# EAGLE board SOTB_Feb22 (EAGLE 9.6.2)
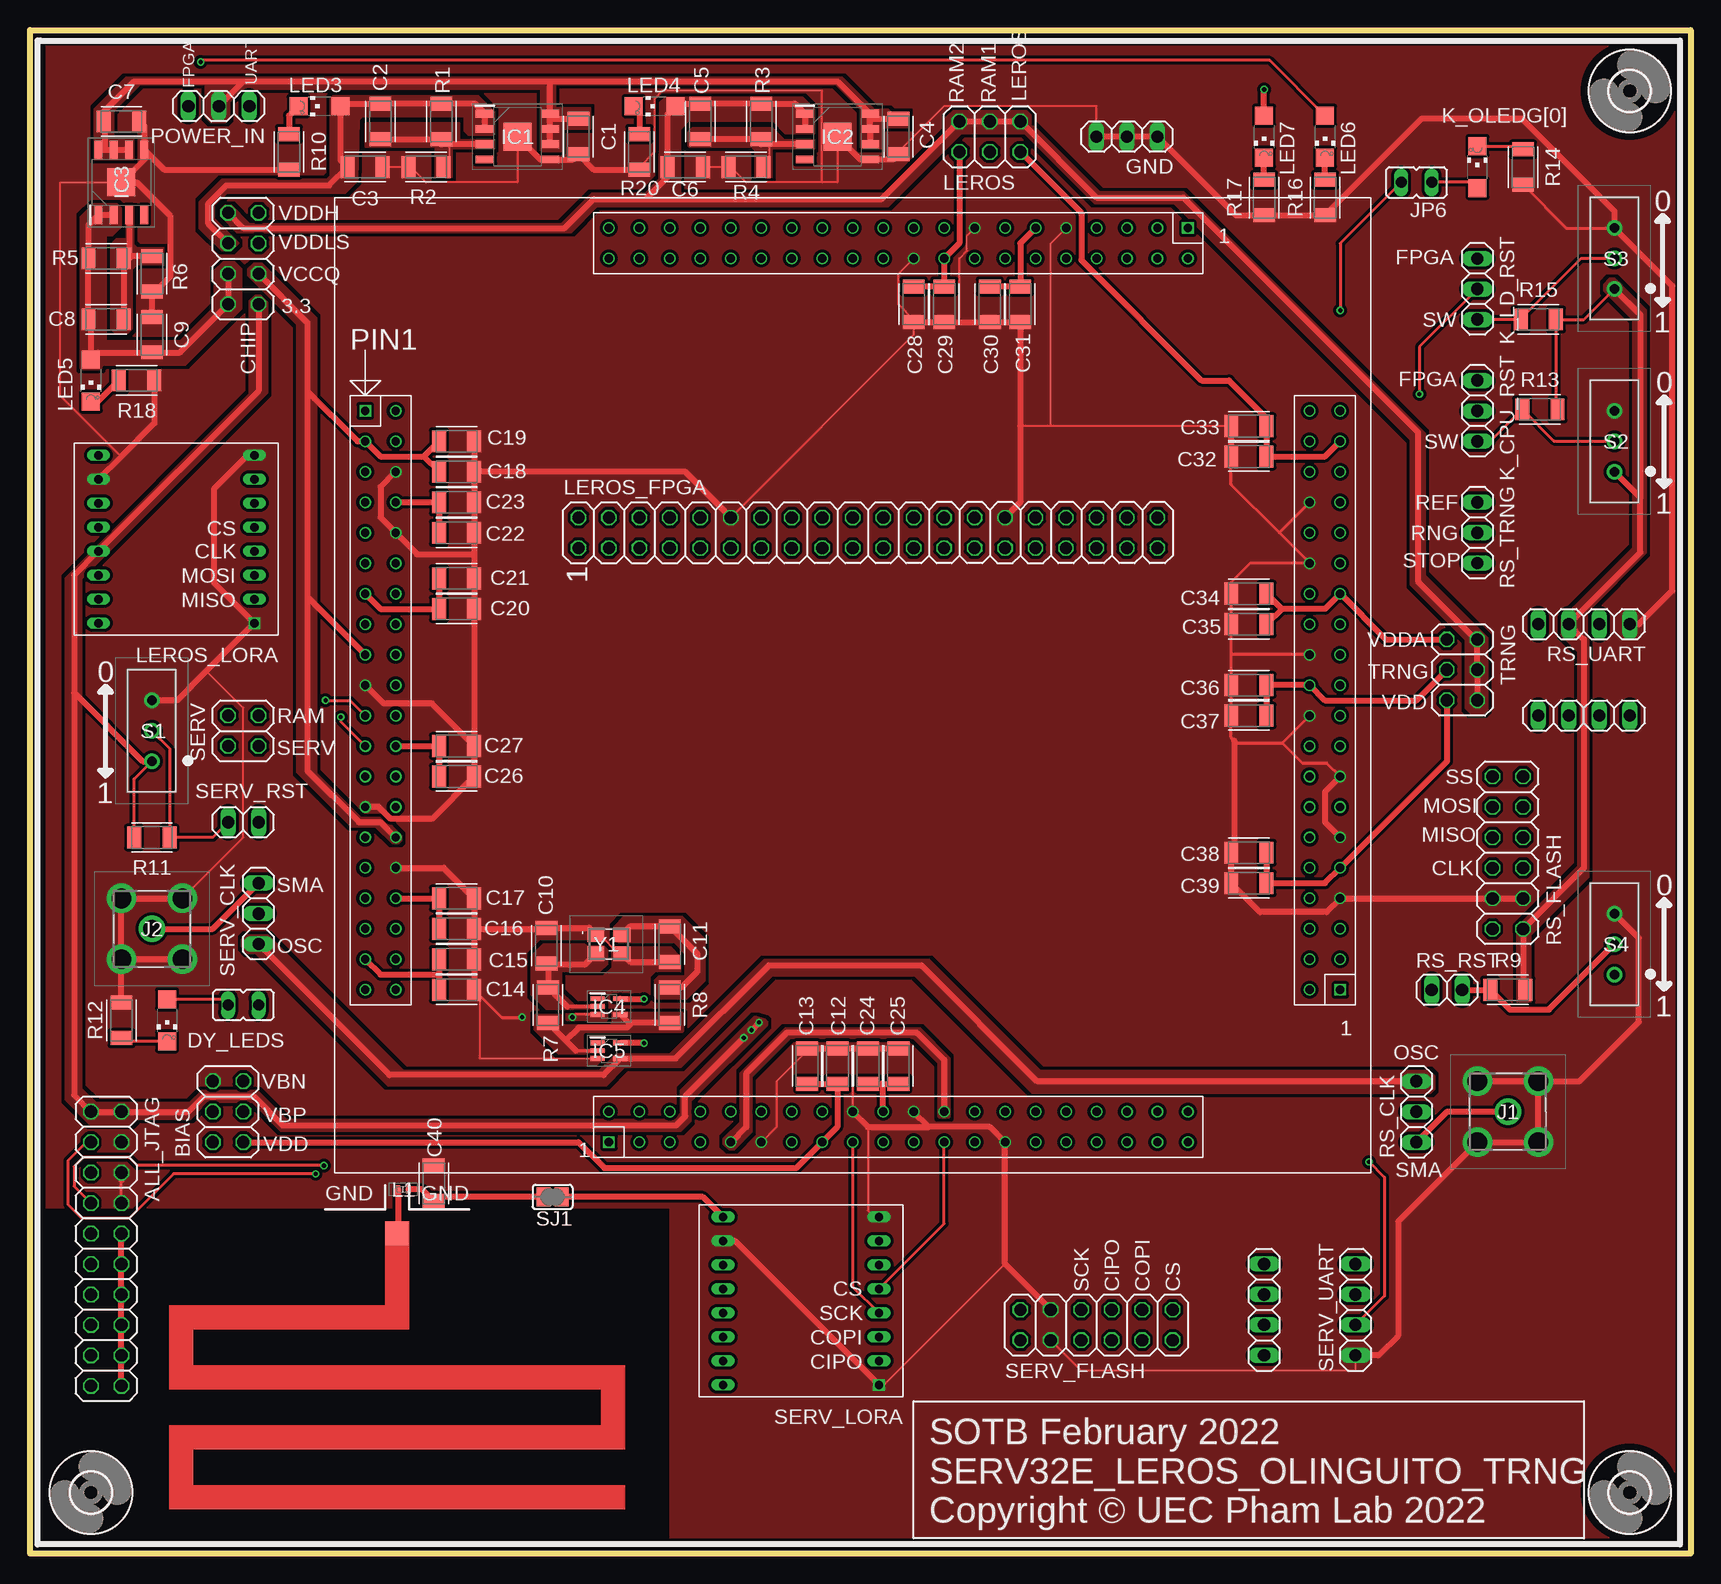
[diagram p2: board, top side]
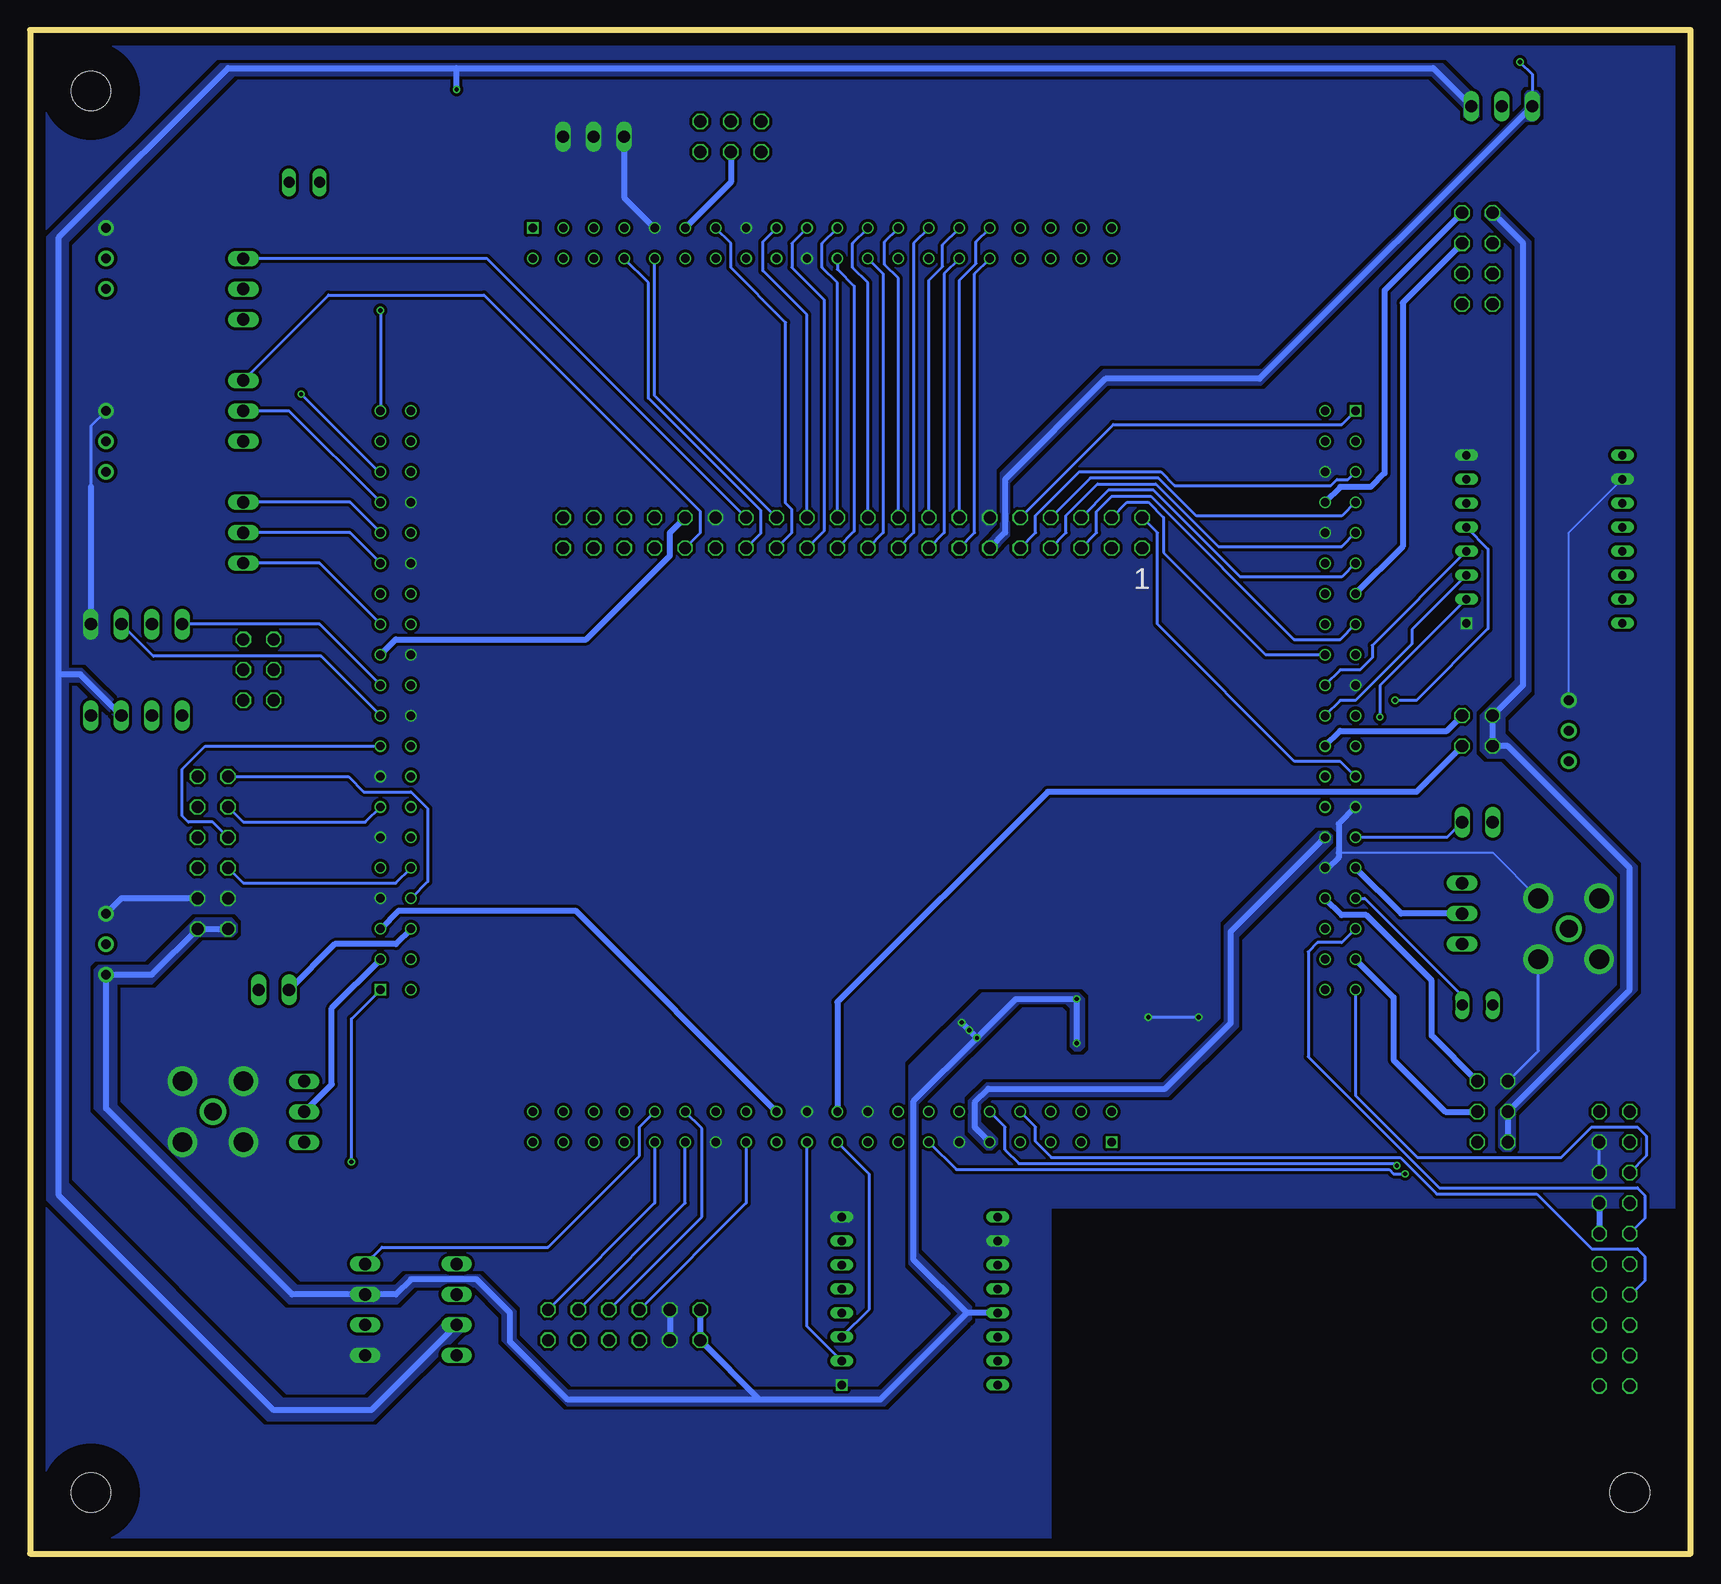
[diagram p3: board, bottom side, seen from below]

Size 138.43 x 127 mm. Coordinates in mm from the lower left corner, seen from the top.
Outline: 0,0 0,127 138.43,127 138.43,0 0,0
Copper layers (1*16): Top 0.035mm / dielectric 1.5mm / Bottom 0.035mm
Design rules "default *": minimum track width 6mil, minimum drill 0.35mm, track to track 10mil, track to pad 10mil, pad to pad 6mil, via to via 10mil, smd to smd 10mil, copper to edge 40mil, drill to drill 6mil, minimum pad ring 0.13mm, minimum via ring 0.13mm, stop-mask expansion 4mil, vias tented up to drill 0mil, thermal gap 10mil

## Footprints (pad centres in the part's own frame; a part is rotated, then mirrored left to right if it is on the bottom)
2X10 = drill 1.016 octagon: 1 -11.43,-1.27; 2 -11.43,1.27; 3 -8.89,-1.27; 4 -8.89,1.27; 5 -6.35,-1.27; 6 -6.35,1.27; 7 -3.81,-1.27; 8 -3.81,1.27; 9 -1.27,-1.27; 10 -1.27,1.27; 11 1.27,-1.27; 12 1.27,1.27; 13 3.81,-1.27; 14 3.81,1.27; 15 6.35,-1.27; 16 6.35,1.27; 17 8.89,-1.27; 18 8.89,1.27; 19 11.43,-1.27; 20 11.43,1.27
2X03 = drill 1.016 octagon: 1 -2.54,-1.27; 2 -2.54,1.27; 3 0,-1.27; 4 0,1.27; 5 2.54,-1.27; 6 2.54,1.27
CAPC3216X135 = smd 1.165 x 1.815: 1 -1.475,0; 2 1.475,0
2X04 = drill 1.016 octagon: 1 -3.81,-1.27; 2 -3.81,1.27; 3 -1.27,-1.27; 4 -1.27,1.27; 5 1.27,-1.27; 6 1.27,1.27; 7 3.81,-1.27; 8 3.81,1.27
CHIPLED_1206 = smd 1.5 x 1.5: A 0,-1.75; C 0,1.75
1X03 = drill 1.016 long: 1 -2.54,0; 2 0,0; 3 2.54,0
3,3 = hole 3.3: 0,0
SOIC127P600X170-9N = smd 1.525 x 0.65: 1 -2.712,1.905; 2 -2.712,0.635; 3 -2.712,-0.635; 4 -2.712,-1.905; 5 2.712,-1.905; 6 2.712,-0.635; 7 2.712,0.635; 8 2.712,1.905 | smd 2.34 x 2.34: 9 0,0
SOT65P210X110-5N = smd 1.2 x 0.4: 1 -0.95,0.65; 2 -0.95,0; 3 -0.95,-0.65; 4 0.95,-0.65; 5 0.95,0.65
29856004 = drill 1.64 pad 2.46: 1 0,0; 2 5.08,0; 3 5.08,5.08; 4 0,5.08 | drill 1.47 pad 2.205: 5 2.54,2.54
JP1 = drill 0.914 long: 1 0,-1.27; 2 0,1.27
LQG15WH0N7B02D = smd 0.35 x 0.65: 1 -0.425,0; 2 0.425,0
2X20 = drill 1.016 octagon: 1 -24.13,-1.27; 2 -24.13,1.27; 3 -21.59,-1.27; 4 -21.59,1.27; 5 -19.05,-1.27; 6 -19.05,1.27; 7 -16.51,-1.27; 8 -16.51,1.27; 9 -13.97,-1.27; 10 -13.97,1.27; 11 -11.43,-1.27; 12 -11.43,1.27; 13 -8.89,-1.27; 14 -8.89,1.27; 15 -6.35,-1.27; 16 -6.35,1.27; 17 -3.81,-1.27; 18 -3.81,1.27; 19 -1.27,-1.27; 20 -1.27,1.27; 21 1.27,-1.27; 22 1.27,1.27; 23 3.81,-1.27; 24 3.81,1.27; 25 6.35,-1.27; 26 6.35,1.27; 27 8.89,-1.27; 28 8.89,1.27; 29 11.43,-1.27; 30 11.43,1.27; 31 13.97,-1.27; 32 13.97,1.27; 33 16.51,-1.27; 34 16.51,1.27; 35 19.05,-1.27; 36 19.05,1.27; 37 21.59,-1.27; 38 21.59,1.27; 39 24.13,-1.27; 40 24.13,1.27
RFM95W-915S2 = drill 0.7 square: P$1 -6,5 | drill 0.7 long: P$2 -6,3; P$3 -6,1; P$4 -6,-1; P$5 -6,-3; P$6 -6,-5; P$7 -6,-7; P$8 -6,-9; P$9 7,5; P$10 7,3; P$11 7,1; P$12 7,-1; P$13 7,-3; P$14 7,-5; P$15 7,-7; P$16 7,-9
RESC3216X70 = smd 1.165 x 1.815: 1 -1.475,0; 2 1.475,0
2X06 = drill 1.016 octagon: 1 -6.35,-1.27; 2 -6.35,1.27; 3 -3.81,-1.27; 4 -3.81,1.27; 5 -1.27,-1.27; 6 -1.27,1.27; 7 1.27,-1.27; 8 1.27,1.27; 9 3.81,-1.27; 10 3.81,1.27; 11 6.35,-1.27; 12 6.35,1.27
1X02 = drill 1.016 long: 1 -1.27,0; 2 1.27,0
1X04 = drill 1.016 long: 1 -3.81,0; 2 -1.27,0; 3 1.27,0; 4 3.81,0
SS12SDP2 = drill 0.8 pad 1.3: 1 0,2.54; 2 0,0; 3 0,-2.54
2X02 = drill 1.016 octagon: 1 -1.27,-1.27; 2 -1.27,1.27; 3 1.27,-1.27; 4 1.27,1.27
SJ = smd 1.168 x 1.6: 1 -0.762,0; 2 0.762,0
QFP28-160PIN = drill 0.7 square: P$1 -40.64,22.86; P$41 -20.32,-38.1; P$81 40.64,-25.4; P$121 27.94,38.1 | drill 0.7: P$2 -38.1,22.86; P$3 -40.64,20.32; P$4 -38.1,20.32; P$5 -40.64,17.78; P$6 -38.1,17.78; P$7 -40.64,15.24; P$8 -38.1,15.24; P$9 -40.64,12.7; P$10 -38.1,12.7; P$11 -40.64,10.16; P$12 -38.1,10.16; P$13 -40.64,7.62; P$14 -38.1,7.62; P$15 -40.64,5.08; P$16 -38.1,5.08; P$17 -40.64,2.54; P$18 -38.1,2.54; P$19 -40.64,0; P$20 -38.1,0; P$21 -40.64,-2.54; P$22 -38.1,-2.54; P$23 -40.64,-5.08; P$24 -38.1,-5.08; P$25 -40.64,-7.62; P$26 -38.1,-7.62; P$27 -40.64,-10.16; P$28 -38.1,-10.16; P$29 -40.64,-12.7; P$30 -38.1,-12.7; P$31 -40.64,-15.24; P$32 -38.1,-15.24; P$33 -40.64,-17.78; P$34 -38.1,-17.78; P$35 -40.64,-20.32; P$36 -38.1,-20.32; P$37 -40.64,-22.86; P$38 -38.1,-22.86; P$39 -40.64,-25.4; P$40 -38.1,-25.4; P$42 -20.32,-35.56; P$43 -17.78,-38.1; P$44 -17.78,-35.56; P$45 -15.24,-38.1; P$46 -15.24,-35.56; P$47 -12.7,-38.1; P$48 -12.7,-35.56; P$49 -10.16,-38.1; P$50 -10.16,-35.56; P$51 -7.62,-38.1; P$52 -7.62,-35.56; P$53 -5.08,-38.1; P$54 -5.08,-35.56; P$55 -2.54,-38.1; P$56 -2.54,-35.56; P$57 0,-38.1; P$58 0,-35.56; P$59 2.54,-38.1; P$60 2.54,-35.56; P$61 5.08,-38.1; P$62 5.08,-35.56; P$63 7.62,-38.1; P$64 7.62,-35.56; P$65 10.16,-38.1; P$66 10.16,-35.56; P$67 12.7,-38.1; P$68 12.7,-35.56; P$69 15.24,-38.1; P$70 15.24,-35.56; P$71 17.78,-38.1; P$72 17.78,-35.56; P$73 20.32,-38.1; P$74 20.32,-35.56; P$75 22.86,-38.1; P$76 22.86,-35.56; P$77 25.4,-38.1; P$78 25.4,-35.56; P$79 27.94,-38.1; P$80 27.94,-35.56; P$82 38.1,-25.4; P$83 40.64,-22.86; P$84 38.1,-22.86; P$85 40.64,-20.32; P$86 38.1,-20.32; P$87 40.64,-17.78; P$88 38.1,-17.78; P$89 40.64,-15.24; P$90 38.1,-15.24; P$91 40.64,-12.7; P$92 38.1,-12.7; P$93 40.64,-10.16; P$94 38.1,-10.16; P$95 40.64,-7.62; P$96 38.1,-7.62; P$97 40.64,-5.08; P$98 38.1,-5.08; P$99 40.64,-2.54; P$100 38.1,-2.54; P$101 40.64,0; P$102 38.1,0; P$103 40.64,2.54; P$104 38.1,2.54; P$105 40.64,5.08; P$106 38.1,5.08; P$107 40.64,7.62; P$108 38.1,7.62; P$109 40.64,10.16; P$110 38.1,10.16; P$111 40.64,12.7; P$112 38.1,12.7; P$113 40.64,15.24; P$114 38.1,15.24; P$115 40.64,17.78; P$116 38.1,17.78; P$117 40.64,20.32; P$118 38.1,20.32; P$119 40.64,22.86; P$120 38.1,22.86; P$122 27.94,35.56; P$123 25.4,38.1; P$124 25.4,35.56; P$125 22.86,38.1; P$126 22.86,35.56; P$127 20.32,38.1; P$128 20.32,35.56; P$129 17.78,38.1; P$130 17.78,35.56; P$131 15.24,38.1; P$132 15.24,35.56; P$133 12.7,38.1; P$134 12.7,35.56; P$135 10.16,38.1; P$136 10.16,35.56; P$137 7.62,38.1; P$138 7.62,35.56; P$139 5.08,38.1; P$140 5.08,35.56; P$141 2.54,38.1; P$142 2.54,35.56; P$143 0,38.1; P$144 0,35.56; P$145 -2.54,38.1; P$146 -2.54,35.56; P$147 -5.08,38.1; P$148 -5.08,35.56; P$149 -7.62,38.1; P$150 -7.62,35.56; P$151 -10.16,38.1; P$152 -10.16,35.56; P$153 -12.7,38.1; P$154 -12.7,35.56; P$155 -15.24,38.1; P$156 -15.24,35.56; P$157 -17.78,38.1; P$158 -17.78,35.56; P$159 -20.32,38.1; P$160 -20.32,35.56
868MHZ_ANTENNA_DN024 = smd 2 x 2: P$1 0,1
NX3225GA12MHZSTDCRG2 = smd 1.4 x 1.2: 1 -1.1,-0.8; 2 1.1,-0.8; 3 1.1,0.8; 4 -1.1,0.8

## Placement (x,y rotation side)
ALL_JTAG  [2X10]  6.35,25.4 270 top
BIAS  PINHD-2X3  [2X03]  16.51,36.83 90 top
C1  10uF  [CAPC3216X135]  45.72,118.11 270 top
C2  4.7nF  [CAPC3216X135]  29.21,119.38 270 top
C3  10uF  [CAPC3216X135]  27.94,115.57 0 top
C4  10uF  [CAPC3216X135]  72.39,118.11 270 top
C5  3.3nF  [CAPC3216X135]  55.88,119.38 270 top
C6  10uF  [CAPC3216X135]  54.61,115.57 0 top
C7  10uF  [CAPC3216X135]  7.62,119.38 0 top
C8  2.7nF  [CAPC3216X135]  6.35,102.87 0 top
C9  10uF  [CAPC3216X135]  10.16,101.6 90 top
C10  16pF  [CAPC3216X135]  43.05,50.67 90 top
C11  16pF  [CAPC3216X135]  53.34,50.8 270 top
C12  10uF  [CAPC3216X135]  67.31,40.64 90 top
C13  0.1uF  [CAPC3216X135]  64.77,40.64 90 top
C14  10uF  [CAPC3216X135]  35.56,46.99 0 top
C15  0.1uF  [CAPC3216X135]  35.56,49.53 0 top
C16  10uF  [CAPC3216X135]  35.56,52.07 0 top
C17  0.1uF  [CAPC3216X135]  35.56,54.61 0 top
C18  10uF  [CAPC3216X135]  35.56,90.17 0 top
C19  0.1uF  [CAPC3216X135]  35.56,92.71 0 top
C20  10uF  [CAPC3216X135]  35.56,78.74 0 top
C21  0.1uF  [CAPC3216X135]  35.56,81.28 0 top
C22  10uF  [CAPC3216X135]  35.56,85.09 0 top
C23  0.1uF  [CAPC3216X135]  35.56,87.63 0 top
C24  10uF  [CAPC3216X135]  69.85,40.64 90 top
C25  0.1uF  [CAPC3216X135]  72.39,40.64 90 top
C26  10uF  [CAPC3216X135]  35.56,64.77 0 top
C27  0.1uF  [CAPC3216X135]  35.56,67.31 0 top
C28  10uF  [CAPC3216X135]  73.66,104.14 270 top
C29  0.1uF  [CAPC3216X135]  76.2,104.14 270 top
C30  10uF  [CAPC3216X135]  80.01,104.14 270 top
C31  0.1uF  [CAPC3216X135]  82.55,104.14 270 top
C32  10uF  [CAPC3216X135]  101.6,91.44 180 top
C33  0.1uF  [CAPC3216X135]  101.6,93.98 180 top
C34  10uF  [CAPC3216X135]  101.6,80.01 180 top
C35  0.1uF  [CAPC3216X135]  101.6,77.47 180 top
C36  10uF  [CAPC3216X135]  101.6,72.39 180 top
C37  0.1uF  [CAPC3216X135]  101.6,69.85 180 top
C38  10uF  [CAPC3216X135]  101.6,58.42 180 top
C39  0.1uF  [CAPC3216X135]  101.6,55.88 180 top
C40  2.7pF  [CAPC3216X135]  33.66,30.86 90 top
CHIP  PINHD-2X4  [2X04]  17.78,107.95 90 top
DY_LEDS  [CHIPLED_1206]  11.43,44.45 180 top
GND  [1X03]  91.44,118.11 180 top
H1  MOUNT-HOLE3.3  [3,3]  133.35,5.08 0 top
H2  MOUNT-HOLE3.3  [3,3]  133.35,121.92 0 top
H3  MOUNT-HOLE3.3  [3,3]  5.08,5.08 0 top
IC1  LP38511MR-ADJ_NOPB  [SOIC127P600X170-9N]  40.64,118.11 0 top
IC2  LP38511MR-ADJ_NOPB  [SOIC127P600X170-9N]  67.31,118.11 0 top
IC3  LP38511MR-ADJ_NOPB  [SOIC127P600X170-9N]  7.62,114.3 90 top
IC4  SN74LVC1GU04DCKR  [SOT65P210X110-5N]  48.26,45.59 0 top
IC5  SN74LVC1G14DCKR  [SOT65P210X110-5N]  48.26,41.91 0 top
J1  2985-6004  [29856004]  125.73,39.37 180 top
J2  2985-6004  [29856004]  7.62,49.53 0 top
JP6  [JP1]  115.57,114.3 90 top
JP7  [JP1]  17.78,45.72 270 top
K_CPU_RST  [1X03]  120.65,95.25 270 top
K_LD_RST  [1X03]  120.65,105.41 270 top
K_OLEDG[0]  [CHIPLED_1206]  120.65,115.57 0 top
L1  LQG15HS1N8S02D  [LQG15WH0N7B02D]  31.11,30.35 180 top
LED3  [CHIPLED_1206]  24.13,120.65 90 top
LED4  [CHIPLED_1206]  52.07,120.65 90 top
LED5  [CHIPLED_1206]  5.08,97.79 180 top
LED6  [CHIPLED_1206]  107.95,118.11 180 top
LED7  [CHIPLED_1206]  102.87,118.11 180 top
LEROS  PINHD-2X3  [2X03]  80.01,118.11 0 top
LEROS_FPGA  [2X20]  69.85,85.09 0 top
LEROS_LORA  [RFM95W-915S2]  12.7,82.55 180 top
POWER_IN  [1X03]  15.75,120.65 180 top
R1  1.07k  [RESC3216X70]  34.29,119.38 270 top
R2  1.78k  [RESC3216X70]  33.02,115.57 0 top
R3  1.4k  [RESC3216X70]  60.96,119.38 270 top
R4  1k  [RESC3216X70]  59.69,115.57 0 top
R5  2k  [RESC3216X70]  6.35,107.95 0 top
R6  357  [RESC3216X70]  10.16,106.68 90 top
R7  2.2M  [RESC3216X70]  43.18,45.72 270 top
R8  1k  [RESC3216X70]  53.34,45.72 270 top
R9  10k  [RESC3216X70]  123.19,46.99 0 top
R10  100  [RESC3216X70]  21.59,116.84 90 top
R11  10k  [RESC3216X70]  10.16,59.69 180 top
R12  1k  [RESC3216X70]  7.62,44.45 270 top
R13  10k  [RESC3216X70]  125.86,95.38 0 top
R14  1k  [RESC3216X70]  124.46,115.57 90 top
R15  10k  [RESC3216X70]  125.73,102.87 0 top
R16  1k  [RESC3216X70]  107.95,113.03 90 top
R17  1k  [RESC3216X70]  102.87,113.03 90 top
R18  1k  [RESC3216X70]  8.89,97.79 180 top
R20  330  [RESC3216X70]  50.8,116.84 90 top
RS_CLK  [1X03]  115.57,36.83 90 top
RS_FLASH  PINHD-2X6  [2X06]  123.19,58.42 90 top
RS_RST  [1X02]  118.11,46.99 0 top
RS_TRNG  PINHD-1X3  [1X03]  120.65,85.09 270 top
RS_UART  PINHD-1X4  [1X04]  129.54,77.47 180 top
S1  SS12SDP2  [SS12SDP2]  10.16,68.58 180 top
S2  SS12SDP2  [SS12SDP2]  132.08,92.71 180 top
S3  SS12SDP2  [SS12SDP2]  132.08,107.95 180 top
S4  SS12SDP2  [SS12SDP2]  132.08,50.8 180 top
SERV  PINHD-2X2  [2X02]  17.78,68.58 90 top
SERV_CLK  [1X03]  19.05,53.34 270 top
SERV_FLASH  PINHD-2X6  [2X06]  88.9,19.05 0 top
SERV_LORA  [RFM95W-915S2]  64.77,19.05 180 top
SERV_RST  [1X02]  17.78,60.96 180 top
SERV_UART  PINHD-1X4  [1X04]  110.49,20.32 90 top
SJ1  [SJ]  43.56,29.72 180 top
SOCKET  [QFP28-160PIN]  68.58,72.39 0 top
TRNG  PINHD-2X3  [2X03]  119.38,73.66 270 top
U$1  [868MHZ_ANTENNA_DN024]  30.61,27.69 180 top
USB-UART_2  PINHD-1X4  [1X04]  102.87,20.32 90 top
USB-UART_4  PINHD-1X4  [1X04]  129.54,69.85 180 top
Y1  NX3225GA-12MHZ-STD-CRG-2  [NX3225GA12MHZSTDCRG2]  48.26,50.8 0 top

## Tracks (layer width: path | path; a pad name or v marks a point on that pad's centre or on a via)
CLOCK_OSC
  Top 0.508: SERV_CLK.3 29.97,39.88 47.83,39.88 IC5.4 53.83,41.26 61.59,49.02 74.3,49.02 83.95,39.37 RS_CLK.3
  pour Top (no thermals): 48.89,41.66 47.5,40.26 31.11,40.26 19.81,51.56 18.03,51.56 17.65,51.18 17.65,50.55 18.16,50.04 18.8,50.04 29.84,38.99 48.01,38.99 49.53,40.51 54.23,40.51 61.85,48.13 73.79,48.13 83.57,38.35 116.71,38.35 117.09,38.73 117.09,39.75 116.59,40.26 84.2,40.26 74.93,49.53 61.21,49.53 53.34,41.66
DY_ALL_I_SPI_CIPO
  Bottom 0.254: SERV_LORA.P$2 73.66,18.94 SOCKET.P$61
DY_ALL_I_SPIFLASH_CIPO
  Bottom 0.254: SERV_FLASH.8 82.42,28.07 82.42,35.43 SOCKET.P$70
DY_ALL_I_TCK
  Bottom 0.254: SOCKET.P$35 29.08,50.93 31.11,50.93 31.88,50.17 31.88,41.4 20.95,30.48 4.45,30.48 3.81,29.84 3.81,27.94 ALL_JTAG.9
DY_ALL_I_TDI
  Bottom 0.254: SOCKET.P$39 27.94,38.18 22.78,33.02 10.79,33.02 8.25,35.56 4.45,35.56 3.68,34.8 3.68,33.15 ALL_JTAG.5
DY_ALL_I_TMS  (via drill 0.35)
  Top 0.254: ALL_JTAG.7 3.68,30.61 3.68,32.26 4.45,33.02 8.25,33.02 8.94,32.33 v24.5,32.33
  Bottom 0.254: SOCKET.P$50 57.15,35.56 57.15,33.66 56.01,32.51 24.68,32.51 v24.5,32.33
DY_ALL_I_TRST  (via drill 0.35)
  Top 0.254: v23.81,31.65 11.96,31.65 8.25,27.94 4.32,27.94 3.17,29.08 3.17,32.77 4.7,34.29 ALL_JTAG.3
  Bottom 0.254: SOCKET.P$53 61.21,32 25.14,32 24.78,31.65 v23.81,31.65
DY_ALL_LEDS[0]
  Bottom 0.254: SOCKET.P$33 27.18,54.61 19.05,46.48 JP7.2
DY_ALL_O_SPI_COPI
  Bottom 0.254: SERV_LORA.P$3 68.45,20.37 68.45,31.62 SOCKET.P$59
DY_ALL_O_SPI_CS
  Top 0.254: SERV_LORA.P$5 76.2,27.48 SOCKET.P$63
DY_ALL_O_SPI_SCK
  Top 0.254: SOCKET.P$57 68.58,22.24 SERV_LORA.P$4
DY_ALL_O_SPIFLASH_COPI
  Bottom 0.254: SERV_FLASH.10 83.82,29.21 SOCKET.P$69
DY_ALL_O_SPIFLASH_CS
  Bottom 0.254: SOCKET.P$71 86.36,29.21 SERV_FLASH.12
DY_ALL_O_SPIFLASH_SCK
  Bottom 0.254: SOCKET.P$65 78.74,29.21 SERV_FLASH.6
DY_ALL_O_TDO
  Bottom 0.254: SOCKET.P$48 54.61,35.56 54.61,34.34 53.29,33.02 24.21,33.02 21.16,29.97 12.83,29.97 8.25,25.4 4.45,25.4 3.81,24.77 3.81,22.73 4.95,21.59 ALL_JTAG.13
DY_ALL_RESET
  Bottom 0.254: SERV_RST.1 20.32,59.69 SOCKET.P$29
DY_ALL_RX_IN  (via drill 0.35)
  Top 0.254: SERV_UART.2 112.9,21.46 112.9,31.37 v111.63,32.64
  Bottom 0.254: v111.63,32.64 111.63,44.58 SOCKET.P$81
DY_ALL_TX_OUT
  Bottom 0.254: SERV_UART.4 109.09,25.53 95.25,25.53 87.63,33.15 87.63,35.56 SOCKET.P$72
DY_CLOCK
  Bottom 0.508: SERV_CLK.2 24.13,53.34 SOCKET.P$31
DY_RAM_VDD
  Top 0.508: SOCKET.P$24 C27.1 C26.1
  Bottom 0.508: SERV.3 20.32,68.58 29.21,68.58 SOCKET.P$24
DY_SERV_VDD
  Top 0.508: C24.1 70.99,39.17 | 70.99,39.17 C25.1 | SOCKET.P$60 71.12,39.04 70.99,39.17
  Bottom 0.508: SERV.1 22.86,63.5 53.59,63.5 71.12,45.97 SOCKET.P$60
GND  (via drill 0.35)
  Top 0.152: 14.71,73.56 17.78,70.48 17.78,59.69 J2.3 | IC3.9 2.54,114.3 2.54,96.52 7.6,91.45 | C3.2 R2.1 31.75,115.57 33.02,114.3 40.64,114.3 IC1.9 | C6.2 R4.1 58.42,115.57 59.69,114.3 66.04,114.3 | 66.04,114.3 67.31,114.3 IC2.9 | 66.04,114.3 66.04,121.92 52.7,121.92 52.07,121.28 52.07,116.84 50.8,115.57 R20.1 | GND.3 88.9,120.65 76.2,120.65 72.39,116.84 C4.2 | 69.85,35.56 69.85,28.58 70.48,27.94 SERV_LORA.P$8 | SOCKET.P$51 62.23,35.56 62.23,39.37 64.77,41.91 C13.2 | 68.58,42.11 SOCKET.P$58 | 81.28,24.13 71.12,13.97 SERV_LORA.P$1 | IC5.3 46.99,41.28 37.46,41.28 37.46,46.99 C14.2 | Y1.2 48.89,50.17 47.62,51.44 Y1.4 | SOCKET.P$140 72.39,106.68 72.39,104.14 73.66,102.87 C28.2 73.66,101.6 LEROS_FPGA.12 | SOCKET.P$135 78.1,109.86 78.1,108.59 77.47,107.95 77.47,102.66 | C33.2 85.09,93.98 | 85.09,93.98 82.55,93.98 | SERV_FLASH.3 87.63,15.24 110.49,15.24 SERV_UART.1 | SOCKET.P$129 85.09,109.22 85.09,93.98 | ALL_JTAG.8 7.62,30.02
  Top 0.254: R14.1 128.06,110.49 S3.3 | 104.14,85.09 SOCKET.P$110 101.73,82.55 100.12,80.95 C34.2 C35.2 100.12,74.93 | 104.14,85.09 100.12,89.1 100.12,91.19 C32.2 | SOCKET.P$114 104.14,85.09 | 100.12,74.93 C36.2 C37.2 100.12,68.02 100.39,67.75 100.58,67.56 104.39,67.56 | SOCKET.P$104 100.12,74.93 | SOCKET.P$100 104.39,67.56 | SOCKET.P$95 108.08,65.91 106.05,65.91 104.39,67.56 | IC4.3 45.45,44.94 v45.21,44.7 | C14.2 39.32,44.7 v41.02,44.7 | ALL_JTAG.8 ALL_JTAG.6
  Top 0.508: IC1.9 42.55,116.2 IC1.5 45.29,116.2 C1.2 46.99,115.36 R20.1 | R6.1 10.16,104.9 | 10.16,104.9 C9.2 | IC3.5 9.52,116.2 IC3.9 8.89,114.3 11.68,111.51 11.68,106.43 10.16,104.9 | C7.2 9.52,118.95 IC3.5 | IC3.5 11.17,115.36 R10.1 | C16.2 C17.2 34.49,57.15 SOCKET.P$32 | C16.2 C15.2 C14.2 | C16.2 42.97,52.07 C10.2 46.61,52.15 Y1.4 | Y1.2 50.03,49.33 C11.2 | J2.1 J2.4 J2.3 | J2.2 J2.1 | R12.1 J2.1 | S1.3 12.27,71.12 14.71,73.56 LEROS_LORA.P$1 15.37,80.88 15.37,88.77 18.14,91.55 LEROS_LORA.P$8 | R18.1 10.36,94.22 7.6,91.45 LEROS_LORA.P$15 | J1.1 J1.4 J1.3 114.05,27.69 114.05,18.16 112.39,16.51 SERV_UART.1 | J1.1 J1.2 | C4.2 71.96,116.2 IC2.5 69.22,116.2 IC2.9 | R17.1 R16.1 | R16.1 100.53,111.56 GND.1 GND.2 GND.3 | C28.2 C29.2 77.47,102.66 C30.2 C31.2 82.55,93.98 82.55,87.63 LEROS_FPGA.30 | C33.2 100.12,91.19 | SOCKET.P$27 29.08,62.23 30.07,61.24 33.51,61.24 C26.2 C27.2 | C27.2 33.48,70.87 29.46,70.87 SOCKET.P$19 | C21.2 C20.2 | C19.2 C18.2 | C18.2 C23.2 C22.2 37.03,83.31 | 37.03,83.31 C21.2 | C21.2 C27.2 | SOCKET.P$6 29.21,88.9 29.21,86.36 SOCKET.P$10 32.26,83.31 37.03,83.31 | LEROS_FPGA.12 54.61,90.17 C18.2 | R16.1 116.03,119.63 124.33,119.63 132.08,111.89 S3.3 136.91,105.66 136.91,80.26 134.11,77.47 RS_UART.1 | RS_FLASH.3 RS_FLASH.4 SOCKET.P$87 108.08,53.47 102.54,53.47 C39.2 C38.2 100.39,58.69 100.39,67.75 | SOCKET.P$95 107.95,63.5 107.95,60.96 SOCKET.P$91 | J1.1 129.16,39.37 134.11,44.32 134.11,51.31 S4.3 | SERV_FLASH.4 81.28,24.13 SOCKET.P$67 80.01,35.56 74.93,35.56 | 74.93,35.56 SOCKET.P$62 | SOCKET.P$58 69.85,35.56 74.93,35.56 | C13.2 C12.2 68.58,42.11 C24.2 C25.2 | SERV_LORA.P$1 58.77,26.05 SERV_LORA.P$15 57.75,26.03
  Top 0.508: ALL_JTAG.20 ALL_JTAG.18 ALL_JTAG.16 ALL_JTAG.14 ALL_JTAG.12 ALL_JTAG.10 | ALL_JTAG.6 7.62,31.11
  Bottom 0.152: LEROS_LORA.P$15 10.16,85.09 S1.3 | J2.3 16.51,58.42 29.34,58.42
  Bottom 0.254: BIAS.6 12.7,41.91 J2.2 | v41.02,44.7 v45.21,44.7 | ALL_JTAG.6 ALL_JTAG.4 | S2.3 133.35,93.98 133.35,88.77
  Bottom 0.508: SOCKET.P$27 29.34,60.83 29.34,58.42 29.34,58.04 30.23,57.15 SOCKET.P$32 | GND.3 88.9,113.03 SOCKET.P$129 | 133.35,88.9 133.35,88.77 RS_UART.1 | RS_FLASH.3 130.81,54.61 S4.3 | SERV_FLASH.4 SERV_FLASH.3 | ALL_JTAG.8 ALL_JTAG.10
  pour Top (rank 2, no thermals): -3.81,132.08 146.05,132.08 146.05,-10.16 53.34,-10.16 53.34,28.83 -3.81,28.83
  pour Bottom (rank 2, no thermals): -5.08,132.08 147.32,132.08 147.32,-11.43 53.34,-11.43 53.34,28.83 -5.08,28.83
IN_3.3
  Top 0.508: IC1.6 IC1.7 43.35,119.51 | 43.35,119.51 IC1.8 43.35,122.64 43.31,122.68 | IC2.6 IC2.7 70.02,119.38 | IC3.8 6.22,117.01 | 6.22,117.01 IC3.7 IC3.6 | 6.22,117.01 6.22,119.3 C7.1 6.14,120.19 8.64,122.68 17.78,122.68 | 70.02,119.38 IC2.8 67.35,122.68 43.31,122.68 | 70.02,119.38 70.23,119.58 C4.1 | 17.78,122.68 POWER_IN.2 | 43.31,122.68 17.78,122.68 | 43.35,119.51 43.43,119.58 C1.1
  pour Top (no thermals): 8.64,118.11 8.64,116.2 5.33,116.2 5.33,120.4 8,123.06 67.69,123.06 70.36,120.4 71.5,120.4 71.75,120.14 73.28,120.14 73.28,118.87 70.99,118.87 70.99,117.09 69.34,117.09 69.22,117.22 69.22,120.4 67.18,122.43 43.81,122.43 43.81,120.52 46.74,120.52 46.74,118.75 44.32,118.75 44.32,116.84 42.67,116.84 42.55,116.97 42.55,122.05 17.65,122.05 16.64,121.03 16.64,119.63 16.26,119.25 15.11,119.25 14.6,119.76 14.6,122.43 9.14,122.43 6.98,120.27 6.98,118.11
K_CLK
  Bottom 0.508: SOCKET.P$103 107.95,76.2 92.07,76.2 85.09,83.19 85.09,85.09 LEROS_FPGA.32
K_CPU_RST_N
  Bottom 0.254: SOCKET.P$113 116.84,95.25 K_CPU_RST.2
K_CPU_RST_N_FPGA
  Bottom 0.254: LEROS_FPGA.31 82.55,85.09 82.55,86.87 100.58,104.9 113.54,104.9 K_CPU_RST.1
K_FL_ADDR[0]
  Bottom 0.254: LEROS_FPGA.27 77.51,85.05 77.51,86.95 86.87,96.31 86.87,105.92 SOCKET.P$128
K_FL_ADDR[1]
  Bottom 0.254: LEROS_FPGA.26 86.36,96.52 SOCKET.P$130
K_FL_ADDR[2]
  Bottom 0.254: LEROS_FPGA.25 74.93,85.09 74.93,87.04 75.44,87.55 75.44,102.62 80.01,107.19 80.01,109.22 SOCKET.P$133
K_FL_ADDR[3]
  Bottom 0.254: LEROS_FPGA.24 73.66,103.25 77.34,106.93 77.34,109.35 SOCKET.P$137
K_FL_ADDR[4]
  Bottom 0.254: LEROS_FPGA.23 72.26,85.22 72.26,104.52 74.93,107.19 74.93,109.22 SOCKET.P$139
K_FL_ADDR[5]
  Bottom 0.254: LEROS_FPGA.22 71.12,105.92 72.39,107.19 72.39,109.22 SOCKET.P$141
K_FL_ADDR[6]
  Bottom 0.254: SOCKET.P$142 71.12,107.06 69.72,105.66 69.72,85.22 LEROS_FPGA.21
K_FL_ADDR[7]
  Bottom 0.254: LEROS_FPGA.20 68.58,105.92 69.85,107.19 69.85,109.22 SOCKET.P$143
K_FL_ADDR[8]
  Bottom 0.254: SOCKET.P$144 67.31,106.68 67.31,85.09 LEROS_FPGA.19
K_FL_ADDR[9]
  Bottom 0.254: LEROS_FPGA.18 66.04,106.3 67.18,107.44 67.18,109.35 SOCKET.P$145
K_FL_CE_N
  Bottom 0.254: LEROS_FPGA.7 52.07,85.09 52.07,86.53 49.45,89.15 44.58,89.15 39.37,83.95 29.08,83.95 SOCKET.P$9
K_FL_DATA[0]
  Bottom 0.254: SOCKET.P$147 64.77,109.22 64.77,85.09 LEROS_FPGA.17
K_FL_DATA[1]
  Bottom 0.254: LEROS_FPGA.16 63.5,106.13 62.36,107.27 62.36,109.09 SOCKET.P$149
K_FL_DATA[2]
  Bottom 0.254: SOCKET.P$150 62.23,106.68 62.23,85.09 LEROS_FPGA.15
K_FL_DATA[3]
  Bottom 0.254: LEROS_FPGA.14 60.96,106.13 59.56,107.53 59.56,109.35 SOCKET.P$151
K_FL_DATA[4]
  Bottom 0.254: LEROS_FPGA.13 59.69,85.09 59.69,106.68 SOCKET.P$152
K_FL_DATA[5]
  Bottom 0.254: LEROS_FPGA.10 48.13,94.11 29.08,94.11 SOCKET.P$1
K_FL_DATA[6]
  Bottom 0.254: LEROS_FPGA.9 54.61,85.09 54.61,86.53 50.97,90.17 44.16,90.17 43.02,89.03 29.98,89.03 29.47,89.53 28.57,89.53 SOCKET.P$5
K_FL_DATA[7]
  Bottom 0.254: SOCKET.P$7 29.08,86.49 41.2,86.49 44.37,89.66 50.04,89.66 LEROS_FPGA.8
K_FL_OE_N
  Bottom 0.254: SOCKET.P$11 29.08,81.41 37.55,81.41 44.79,88.65 48.51,88.65 LEROS_FPGA.6
K_FL_RST_N
  Bottom 0.254: LEROS_FPGA.4 46.99,87.63 45.21,87.63 43.94,86.36 43.94,83.44 35.43,74.93 SOCKET.P$18
K_FL_WE_N
  Bottom 0.254: LEROS_FPGA.5 49.53,85.09 49.53,86.87 48.26,88.14 45,88.14 33.06,76.2 29.21,76.2 SOCKET.P$15
K_FLASH_LOADED
  Bottom 0.254: SOCKET.P$25 29.21,66.04 33.02,66.04 44.45,77.47 44.45,85.09 LEROS_FPGA.2
K_LEROS_RAM_1_VDD
  Top 0.508: SOCKET.P$131 82.55,109.22 C31.1 C30.1
  Bottom 0.508: SOCKET.P$131 80.01,114.3 LEROS.3
K_LEROS_RAM_2_VDD
  Top 0.508: LEROS.1 77.47,109.22 SOCKET.P$138 C29.1 C28.1
K_LEROS_VDD
  Top 0.508: LEROS.5 87.63,111.76 87.63,107.82 97.66,97.79 99.95,97.79 103.08,94.66 C33.1 C32.1 107.95,91.44 SOCKET.P$117
K_LOADER_RST_N  (via drill 0.35)
  Top 0.254: K_LD_RST.2 115.82,100.58 v115.82,96.65
  Bottom 0.254: v115.82,96.65 109.35,90.17 SOCKET.P$115
K_LOADER_RST_N_FPGA
  Bottom 0.254: LEROS_FPGA.28 100.33,107.95 K_LD_RST.1
K_OLEDG[0]  (via drill 0.35)
  Top 0.254: JP6.2 109.22,109.22 v109.22,103.63
  Bottom 0.254: v109.22,103.63 SOCKET.P$119
K_SPI_CLK
  Bottom 0.254: SOCKET.P$20 29.21,73.66 27.56,73.66 26.54,74.68 26.54,75.71 LEROS_LORA.P$4
K_SPI_CS_N  (via drill 0.35)
  Top 0.254: v24.64,71.12 26.67,71.12 SOCKET.P$21
  Bottom 0.254: LEROS_LORA.P$5 16.89,83.74 16.89,77.09 22.86,71.12 v24.64,71.12
K_SPI_MISO  (via drill 0.35)
  Top 0.254: v25.91,69.72 25.91,69.34 SOCKET.P$23
  Bottom 0.254: LEROS_LORA.P$2 25.91,72.34 v25.91,69.72
K_SPI_MOSI
  Bottom 0.254: LEROS_LORA.P$3 23.24,77.01 23.24,75.82 27.94,71.12 29.21,71.12 SOCKET.P$22
N$1
  Top 0.152: R2.2 34.92,115.57 34.92,117.47 R1.2
  Top 0.508: C2.2 R1.2 34.29,117.47 34.92,117.47 IC1.3
  pour Top (no thermals): 38.73,117.86 38.73,117.09 35.18,117.09 35.18,114.55 33.78,114.55 33.78,117.22 27.94,117.22 27.94,119.25 35.81,119.25 35.81,117.86
N$2
  Top 0.152: R4.2 61.59,115.57 61.59,117.47 R3.2
  Top 0.508: C5.2 R3.2 60.96,117.47 61.59,117.47 IC2.3
  pour Top (no thermals): 55.24,118.87 61.85,118.87 62.86,117.86 65.41,117.86 65.41,117.09 61.85,117.09 61.85,114.68 61.72,114.55 60.58,114.55 60.45,114.68 60.45,116.97 60.2,117.22 54.99,117.22 54.86,117.35 54.86,118.49
N$3
  Top 0.508: 8.25,107.95 R5.2 C8.2 | IC3.3 8.25,107.95 | R6.2 8.46,108.16 8.25,107.95
  pour Top (no thermals): 8,112.27 8,109.6 7.24,109.6 6.73,109.09 6.73,102.11 7.11,101.73 8.13,101.73 8.51,102.11 8.51,107.06 8.89,107.44 11.18,107.44 11.18,108.84 8.89,108.84 8.64,109.09 8.64,112.27
N$4
  Top 0.305: IC4.2 44.78,45.59
  Top 0.508: C10.1 43.18,49.07 | 43.18,49.07 R7.1 44.78,45.59 | Y1.1 46.23,49.07 43.18,49.07
  pour Top (no thermals): 48.01,50.8 48.13,50.67 48.13,49.15 47.5,48.51 44.32,48.51 44.32,46.74 45.09,45.97 45.34,45.72 47.37,45.72 47.88,45.72 47.88,45.47 47.75,45.34 44.7,45.34 43.05,45.34 41.78,46.61 41.78,49.78 42.8,50.8
N$5
  Top 0.305: IC5.2 45.52,41.91
  Top 0.508: 45.52,41.91 44.66,42.76 | 44.66,42.76 R7.2 | R8.2 50.16,44.25 | 50.16,44.25 49.91,44.25 IC4.4 | 50.16,44.25 49.73,43.81 45.72,43.81 44.66,42.76
  pour Top (no thermals): 48.51,45.08 48.51,44.2 48.39,44.07 44.45,44.07 44.32,44.2 44.32,44.83 44.2,44.96 42.16,44.96 42.04,44.83 42.04,43.69 44.07,41.66 47.88,41.66 47.88,42.04 46.23,42.04 46.1,42.16 46.1,43.31 46.23,43.43 54.36,43.43 54.48,43.56 54.48,44.96 54.36,45.08
N$6
  Top 0.254: K_OLEDG[0].C 124.19,117.32 R14.2
N$7
  Top 0.254: DY_LEDS.C 7.89,42.7 R12.2
N$8
  Top 0.508: Y1.3 50.03,52.28 C11.1 55.63,49.99 55.63,48.51 54.31,47.19 R8.1
  pour Top (no thermals): 48.64,51.05 48.64,52.2 49.53,53.09 54.36,53.09 56.26,51.18 56.26,47.75 54.74,46.23 52.32,46.23 52.07,46.48 52.07,47.75 52.45,48.13 54.61,48.13 54.61,50.04 53.72,50.93 49.02,50.93
N$9
  Top 0.508: LED3.C 21.59,119.86 R10.2
N$10
  Top 0.508: LED4.C 50.8,120.17 R20.2
N$11
  Top 0.508: LED5.C 5.66,96.04 R18.2
N$12
  Top 0.254: K_OLEDG[0].A 120.17,114.3 JP6.1
N$13
  Top 0.254: JP7.1 16.03,46.2 DY_LEDS.A
N$15
  Top 0.508: R16.2 LED6.C
N$16
  Top 0.508: R17.2 LED7.C
N$26
  Top 0.508: SJ1.2 33.99,29.72 C40.1 32.69,30.35 L1.1
N$27
  Top 0.508: L1.2 30.69,26.77 U$1.P$1
N$28
  Top 0.508: SERV_LORA.P$16 56.1,29.72 SJ1.1
OUT_0.8
  Top 0.508: IC1.2 IC1.1 37.09,120.86 R1.1 C2.1 26.09,120.86 LED3.A 25.88,116.16 C3.1 24.94,114.05 16.38,114.05 14.86,112.52 14.86,110.87 CHIP.6
  pour Top (no thermals): 38.73,118.36 38.73,120.14 37.34,121.54 25.27,121.54 25.02,121.28 25.02,114.81 24.77,114.55 16,114.55 14.1,112.65 14.1,110.49 16,108.59 16.76,108.59 17.4,109.22 15.37,111.25 15.37,112.39 16.38,113.41 26.29,113.41 27.3,114.43 27.43,119.51 27.69,119.76 36.2,119.76 36.2,118.62 36.58,118.24 38.61,118.24
OUT_1.2
  Top 0.508: IC2.2 IC2.1 63.76,120.86 R3.1 C5.1 54.02,120.86 LED4.A 53.13,119.97 C6.1 53.13,114.73 51.31,112.9 | CHIP.8 17.78,110.49 44.58,110.49 46.99,112.9 51.31,112.9 | 51.31,112.9 70.99,112.9 LEROS.2 LEROS.4 LEROS.6 88.9,113.03 96.14,113.03 115.7,93.47 115.7,81.03 120.52,76.2 TRNG.2 TRNG.4 TRNG.6
  Bottom 0.508: BIAS.2 BIAS.4 5.08,46.99 5.08,57.15 15.24,67.31 SERV.2 SERV.4 13.97,72.39 13.97,109.22 CHIP.8
  pour Top (no thermals): 65.41,118.36 65.41,120.4 64.39,121.41 52.96,121.41 52.45,120.9 52.45,114.55 54.23,114.55 54.23,118.75 54.86,119.38 61.98,119.38 62.99,118.36
  pour Top (no thermals): 15.88,111.51 17.27,110.11 45.09,110.11 47.24,112.27 71.5,112.27 77.6,118.36 82.8,118.36 83.44,119 83.44,119.89 82.8,120.52 77.22,120.52 76.33,119.63 76.33,118.49 71.25,113.41 54.23,113.41 54.23,114.55 52.45,114.55 51.31,113.41 46.86,113.41 44.32,110.87 18.29,110.87 16.76,112.39 16.26,112.39 15.88,112.01
  pour Bottom (no thermals): 16.38,112.39 13.33,109.35 13.33,71.88 15.49,69.72 15.49,68.33 4.45,57.28 4.45,46.99 14.6,36.83 14.6,33.91 14.99,33.53 15.62,33.53 16,33.91 16,36.96 5.84,47.12 5.84,56.64 15.49,66.29 16.89,66.29 17.53,66.93 17.53,69.85 14.6,72.77 14.6,108.97 17.14,111.51 17.14,111.63
  pour Top (no thermals): 120.14,69.98 119.63,70.48 119.63,76.2 115.06,80.77 115.06,92.84 95.38,112.52 88.77,112.52 82.93,118.36 82.55,118.36 83.19,119 83.69,119 89.15,113.54 96.14,113.54 116.33,93.34 116.33,81.53 121.54,76.33 121.54,70.36 121.16,69.98
OUT_3.3
  Top 0.508: IC3.2 IC3.1 4.88,110.75 R5.1 C8.1 5.08,102.66 LED5.A 5.66,100.12 C9.1 12.49,100.12 CHIP.2 CHIP.4
  pour Top (no thermals): 7.24,112.52 5.33,112.52 4.19,111.38 4.19,98.81 4.32,98.68 5.84,98.68 5.97,98.81 5.97,98.93 6.1,99.06 12.95,99.06 17.65,103.76 17.65,107.06 17.02,107.7 16.13,107.7 15.37,106.93 15.37,103.89 12.57,101.09 6.35,101.09 6.35,109.86 6.86,109.86 7.62,110.62 7.62,112.14
RS_CLK
  Bottom 0.508: RS_CLK.2 113.28,39.12 113.28,45.47 SOCKET.P$83
RS_GPI_O0
  Bottom 0.254: SOCKET.P$101 114.3,77.47 RS_UART.4
RS_GPIO_I0
  Bottom 0.254: SOCKET.P$99 114.17,74.8 128.14,74.8 RS_UART.2
RS_QSPI_CLK
  Bottom 0.254: RS_FLASH.6 120.65,55.88 107.95,55.88 SOCKET.P$90
RS_QSPI_MISO
  Bottom 0.254: RS_FLASH.8 123.19,60.96 125.22,60.96 125.73,61.47 125.73,65.41 123.83,67.31 SOCKET.P$97
RS_QSPI_MOSI
  Bottom 0.254: SOCKET.P$93 110.49,60.96 120.65,60.96 RS_FLASH.10
RS_QSPI_SS
  Bottom 0.254: RS_FLASH.12 111.89,64.77 110.62,63.5 106.68,63.5 105.28,62.1 105.28,56.01 SOCKET.P$88
RS_RST
  Bottom 0.508: SOCKET.P$86 107.95,50.8 113.03,50.8 RS_RST.1
RS_TRNG_RO_REF
  Bottom 0.254: SOCKET.P$111 111.76,87.63 RS_TRNG.1
RS_TRNG_RO_RNG
  Bottom 0.254: SOCKET.P$109 111.76,85.09 RS_TRNG.2
RS_TRNG_RO_STOP
  Bottom 0.254: SOCKET.P$105 114.3,82.55 RS_TRNG.3
RS_TRNG_VDD
  Top 0.508: C37.1 C36.1 SOCKET.P$102 107.95,71.12 115.57,71.12 TRNG.3
RS_VDD
  Top 0.508: C38.1 C39.1 107.95,55.88 SOCKET.P$89 118.11,66.04 TRNG.5
RST_SW
  Top 0.254: SERV_RST.2 15.24,59.69 R11.1 11.63,67.1 S1.2
RST_SW1
  Top 0.254: K_CPU_RST.3 121.72,92.71 R13.1 127.02,92.73 132.06,92.73 S2.2
RST_SW2
  Top 0.254: R15.1 124.21,102.87 | 124.21,102.87 K_LD_RST.3 | S3.2 129.29,107.95 124.21,102.87
RST_SW3
  Top 0.508: RS_RST.2 R9.1 123.37,45.34 126.62,45.34 S4.2
SMA_CLK
  Top 0.508: J2.5 15.24,52.07 SERV_CLK.1
SMA_CLK1
  Top 0.508: J1.5 118.11,36.83 RS_CLK.1
VBN
  Top 0.508: C16.1 C17.1 SOCKET.P$34
  Bottom 0.508: SOCKET.P$34 29.08,53.21 27.05,53.21 21.59,47.75 21.59,43.18 BIAS.5
VBP
  Top 0.508: C15.1 34.09,48.26 | 34.09,48.26 C14.1 | SOCKET.P$37 29.21,48.26 34.09,48.26
  Bottom 0.508: SOCKET.P$37 24.77,46.36 24.77,41.15 20.45,36.83 BIAS.3
VCCQ
  Top 0.508: CHIP.3 23.11,102.62 23.11,96.9 | 23.11,96.9 27.3,92.71 SOCKET.P$3 29.21,91.44 32.81,91.44 | C19.1 32.81,91.44 | 32.81,91.44 C18.1 | 23.11,96.9 23.11,79.76 | 23.11,79.76 SOCKET.P$17 | 23.11,79.76 23.11,65.28 27.43,60.96 29.21,60.96 SOCKET.P$30 | SOCKET.P$49 59.69,35.56 59.69,40 63.12,43.43 73.91,43.43 76.2,41.15 SOCKET.P$64
  Bottom 0.508: SOCKET.P$85 107.7,53.59 92.96,53.59 SOCKET.P$64 | SOCKET.P$49 59.69,35.56 59.69,37.59 58.55,38.73 43.81,38.73 38.35,44.2 38.35,51.82 SOCKET.P$30
  pour Top (no thermals): 18.16,106.55 22.22,102.49 22.22,65.15 26.8,60.58 28.83,60.58 30.23,59.18 30.73,59.18 30.99,59.44 30.99,59.82 29.46,61.34 27.56,61.34 23.88,65.02 23.88,103 19.3,107.57 18.67,107.57 18.16,107.06
  pour Bottom (no thermals): 30.23,60.2 29.59,59.56 37.72,51.44 37.72,43.94 43.56,38.1 58.55,38.1 59.18,37.47 59.18,35.94 57.78,34.54 57.78,34.16 58.29,33.66 58.67,33.66 60.2,35.18 60.2,37.72 58.67,39.24 43.94,39.24 38.86,44.32 38.86,52.32 30.99,60.2
  pour Top (no thermals): 57.78,34.54 59.18,35.94 59.18,40 62.99,43.81 74.17,43.81 76.71,41.28 76.71,36.45 76.58,36.32 75.82,36.32 75.69,36.45 75.69,40.89 73.66,42.93 63.37,42.93 60.2,39.75 60.2,35.18 58.67,33.66 58.29,33.66 57.78,34.16
VDD
  Top 0.508: C13.1 C12.1 67.31,35.56 SOCKET.P$55 63.88,32.13 47.88,32.13 45.72,34.29 BIAS.1
VDD_3.3V  (via drill 0.35)
  Top 0.254: R11.2 8.68,64.56 S1.1 | S3.1 129.54,102.87 R15.2 127.2,95.5 R13.2
  Top 0.508: CHIP.1 19.05,96.9 LEROS_LORA.P$12 3.68,81.53 3.68,71.75 | 3.68,71.75 9.4,66.04 S1.1 | R9.2 124.46,47.19 RS_FLASH.1 129.54,57.15 129.54,76.2 RS_UART.3 134.24,83.44 134.24,88.01 | IC4.5 51.17,46.24 v51.18,46.23 | v51.18,42.55 49.22,42.55 IC5.5 | 134.24,88.01 S2.1 | S3.1 134.24,103.25 134.24,88.01 | 3.68,71.75 3.68,38.23 ALL_JTAG.1 ALL_JTAG.2 13.21,36.83 14.48,38.1 18.67,38.1 21.08,35.69 53.85,35.69 54.61,36.45 54.61,38.1 v59.5,42.99 | v60.13,43.62 v60.77,44.26
  Bottom 0.508: SERV_LORA.P$12 60.34,20.05 | 60.34,20.05 67.56,12.83 77.6,12.83 | 77.6,12.83 SERV_FLASH.1 SERV_FLASH.2 | RS_FLASH.2 RS_FLASH.1 128.27,48.26 S4.1 132.08,37.08 116.59,21.59 SERV_UART.3 107.95,21.59 106.68,22.86 101.22,22.86 98.42,20.07 98.42,17.65 93.6,12.83 77.6,12.83 | v51.18,42.55 v51.18,46.23 56.26,46.23 v59.5,42.99 | 60.34,20.05 64.77,24.48 64.77,37.72 v59.5,42.99 | v60.13,43.62 v59.5,42.99 | v59.5,42.99 v60.77,44.26
  pour Top (no thermals): 18.29,104.39 18.29,96.65 3.3,81.66 3.3,81.28 4.32,81.28 19.81,96.77 19.81,104.27 19.18,104.9 18.8,104.9
  pour Bottom (no thermals): 59.94,20.57 64.39,25.02 64.39,37.47 56.01,45.85 52.07,45.85 51.69,45.47 51.69,42.29 51.31,41.91 50.93,41.91 50.55,42.29 50.55,46.23 51.05,46.74 59.05,46.74 65.15,40.64 65.15,24.13 60.33,19.3 60.2,19.3 59.94,19.56
  pour Bottom (no thermals): 60.33,19.18 67.18,12.32 93.6,12.32 99.06,17.78 99.06,18.54 99.06,19.94 101.35,22.22 106.43,22.22 107.82,20.83 110.36,20.83 110.49,20.95 110.49,22.1 110.24,22.35 108.33,22.35 107.95,22.35 107.19,23.11 107.06,23.24 101.6,23.24 100.97,23.24 97.92,20.19 97.92,17.91 93.6,13.59 76.58,13.59 67.44,13.59 61.09,19.94 60.96,19.94 60.33,19.3
  pour Bottom (no thermals): 110.11,22.35 116.2,22.35 131.19,37.34 131.19,48.39 131.7,48.89 132.59,48.89 132.84,48.64 133.1,48.39 133.1,37.08 116.84,20.83 110.11,20.83
  pour Bottom (no thermals): 132.97,47.5 128.27,47.5 124.33,51.44 121.54,51.44 121.16,51.82 121.16,52.45 121.67,52.96 124.59,52.96 128.52,49.02 132.72,49.02 133.1,48.64 133.1,47.62
  pour Top (no thermals): 123.95,46.1 123.95,52.2 126.11,54.36 129.03,57.28 129.03,72.14 129.03,75.18 127.64,76.58 127.64,77.85 130.56,80.77 133.6,83.82 133.6,102.87 131.19,105.28 131.19,105.79 131.7,106.3 132.08,106.3 134.75,103.63 134.75,102.87 134.75,83.44 129.79,78.49 129.79,76.58 129.92,76.45 129.92,56.39 125.09,51.56 125.09,45.97 123.95,45.97
  pour Top (no thermals): 6.48,37.59 13.33,37.59 14.35,38.61 18.92,38.61 21.34,36.19 53.72,36.19 54.23,36.7 54.23,38.61 60.45,44.83 61.21,44.58 61.47,44.32 61.47,44.07 55.12,37.72 55.12,36.07 54.23,35.18 20.95,35.18 18.54,37.59 14.73,37.59 13.33,36.19 8.89,36.19 8.38,35.69 6.73,35.69 6.22,36.19 6.22,37.34
  pour Top (no thermals): 6.98,35.69 5.08,35.69 2.92,37.85 2.92,81.28 3.3,81.66 4.19,81.66 4.32,81.53 4.32,79.76 4.32,38.73 5.46,37.59 6.6,37.59 6.98,37.21
VDD_5V_FPGA  (via drill 0.35)
  Top 0.254: LED6.A 103.35,124.46 14.35,124.46 v14.22,124.33
  Bottom 0.254: v14.22,124.33 13.21,123.32 POWER_IN.3
  Bottom 0.508: POWER_IN.3 35.94,97.92 48.77,97.92 57.15,89.53 57.15,85.09 LEROS_FPGA.11
  pour Bottom (no thermals): 12.57,121.67 12.57,119.89 13.08,119.38 13.84,119.38 35.81,97.41 48.64,97.41 56.77,89.28 56.77,84.84 58.29,83.31 58.67,83.31 58.93,83.57 58.93,84.07 57.53,85.47 57.53,90.04 48.89,98.68 35.69,98.68 13.84,120.52 13.84,121.67 13.59,121.92 12.83,121.92
VDD_5V_UART  (via drill 0.35)
  Top 0.508: LED7.A v102.87,122.05
  Bottom 0.508: USB-UART_2.2 109.98,11.94 118.11,11.94 136.02,29.84 136.02,73.28 | POWER_IN.1 21.46,123.83 102.87,123.83 | 136.02,73.28 136.02,109.73 121.92,123.83 102.87,123.83 | USB-UART_4.2 134.24,73.28 136.02,73.28 | v102.87,122.05 102.87,123.83
  pour Bottom (no thermals): 101.79,19.11 109.86,11.05 118.62,11.05 137.03,29.46 137.03,109.73 122.55,124.21 20.7,124.21 17.65,121.16 17.65,119.76 18.91,119.76 18.91,120.51 21.59,123.19 121.41,123.19 135.25,109.35 135.25,30.86 117.35,12.95 110.24,12.95 103.5,19.69 102.36,19.69
  pour Bottom: 130.43,70.1 134.11,73.79 135.51,73.79 135.51,72.64 134.24,72.64 131.57,69.98 130.94,69.34 130.43,69.34
VDDA
  Top 0.508: C34.1 104.34,78.74 | 104.34,78.74 107.95,78.74 SOCKET.P$107 113.03,76.2 TRNG.1 | 104.34,78.74 C35.1
VDDH
  Top 0.508: C22.1 C23.1 SOCKET.P$8
  Bottom 0.508: CHIP.7 25.53,105.28 25.53,90.04 26.67,88.9 29.21,88.9 SOCKET.P$8
VDDLS
  Top 0.508: C21.1 C20.1 29.21,78.74 SOCKET.P$13
  Bottom 0.508: CHIP.5 24,104.27 24,83.95 SOCKET.P$13

## Text on the board
tPlace: 1 | 1
tNames: FPGA | UART | RAM2 | RAM1 | LEROS | 0 | VDDH | VDDLS | FPGA | VCCQ | 1 | 3.3 | SW | 0 | FPGA | SW | 1 | REF | CS | RNG | CLK | STOP | MOSI | MISO | VDDA | 0 | TRNG | VDD | RAM | SERV | 1 | SS | MOSI | MISO | CLK | 0 | SMA | OSC | 1 | OSC | VBN | VBP | VDD | SMA | SCK | CIPO | COPI | CS | CS | SCK | COPI | CIPO | SOTB February 2022 / SERV32E_LEROS_OLINGUITO_TRNG / Copyright © UEC Pham Lab 2022
bNames: 1